# Altium schematic sheet TP1SCH.SchDoc
size A4
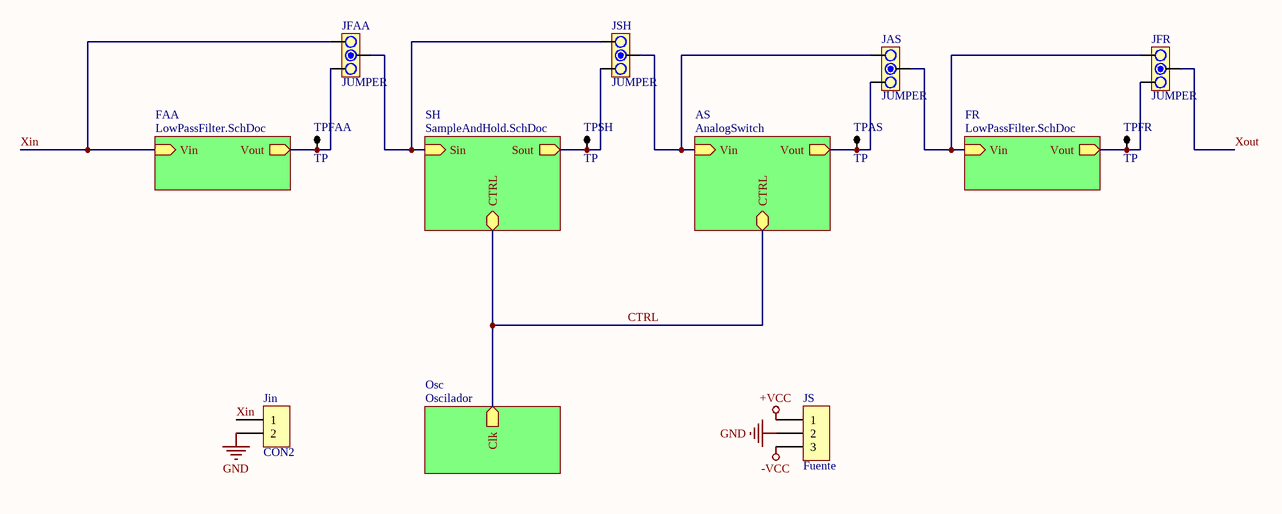
[diagram p0: TP1SCH.SchDoc]

## Parts
JAS  JUMPER  [JUMPER3]
JFAA  JUMPER  [JUMPER3]
JFR  JUMPER  [JUMPER3]
Jin  CON2  [SIP2]
JS  Fuente  [SIP3]
JSH  JUMPER  [JUMPER3]
TPAS  TP  [TPTH]
TPFAA  TP  [TPTH]
TPFR  TP  [TPTH]
TPSH  TP  [TPTH]

## Sub-sheets
AS = AnalogSwitch: Vin (in), CTRL (bidir), Vout (out)
FAA = LowPassFilter.SchDoc: Vin (in), Vout (out)
FR = LowPassFilter.SchDoc: Vin (in), Vout (out)
Osc = Oscilador: Clk (out)
SH = SampleAndHold.SchDoc: Sin (in), Sout (out), CTRL (bidir)

## Nets
+VCC: JS.1
-VCC: JS.3
GND: Jin.2 JS.2
CTRL: sheet SH/CTRL, sheet AS/CTRL, sheet Osc/Clk
Xin: JFAA.3 Jin.1 ; sheet FAA/Vin
Xout: JFR.2
NetJAS_1: JAS.1 TPAS.1 ; sheet AS/Vout
NetJAS_2: JAS.2 JFR.3 ; sheet FR/Vin
NetJAS_3: JAS.3 JSH.2 ; sheet AS/Vin
NetJFAA_1: JFAA.1 TPFAA.1 ; sheet FAA/Vout
NetJFAA_2: JFAA.2 JSH.3 ; sheet SH/Sin
NetJFR_1: JFR.1 TPFR.1 ; sheet FR/Vout
NetJSH_1: JSH.1 TPSH.1 ; sheet SH/Sout

## Library data of the parts
JAS JFAA JFR JSH = JUMPER3
JS = CON3